# Altium schematic sheet camera.SchDoc
size A3
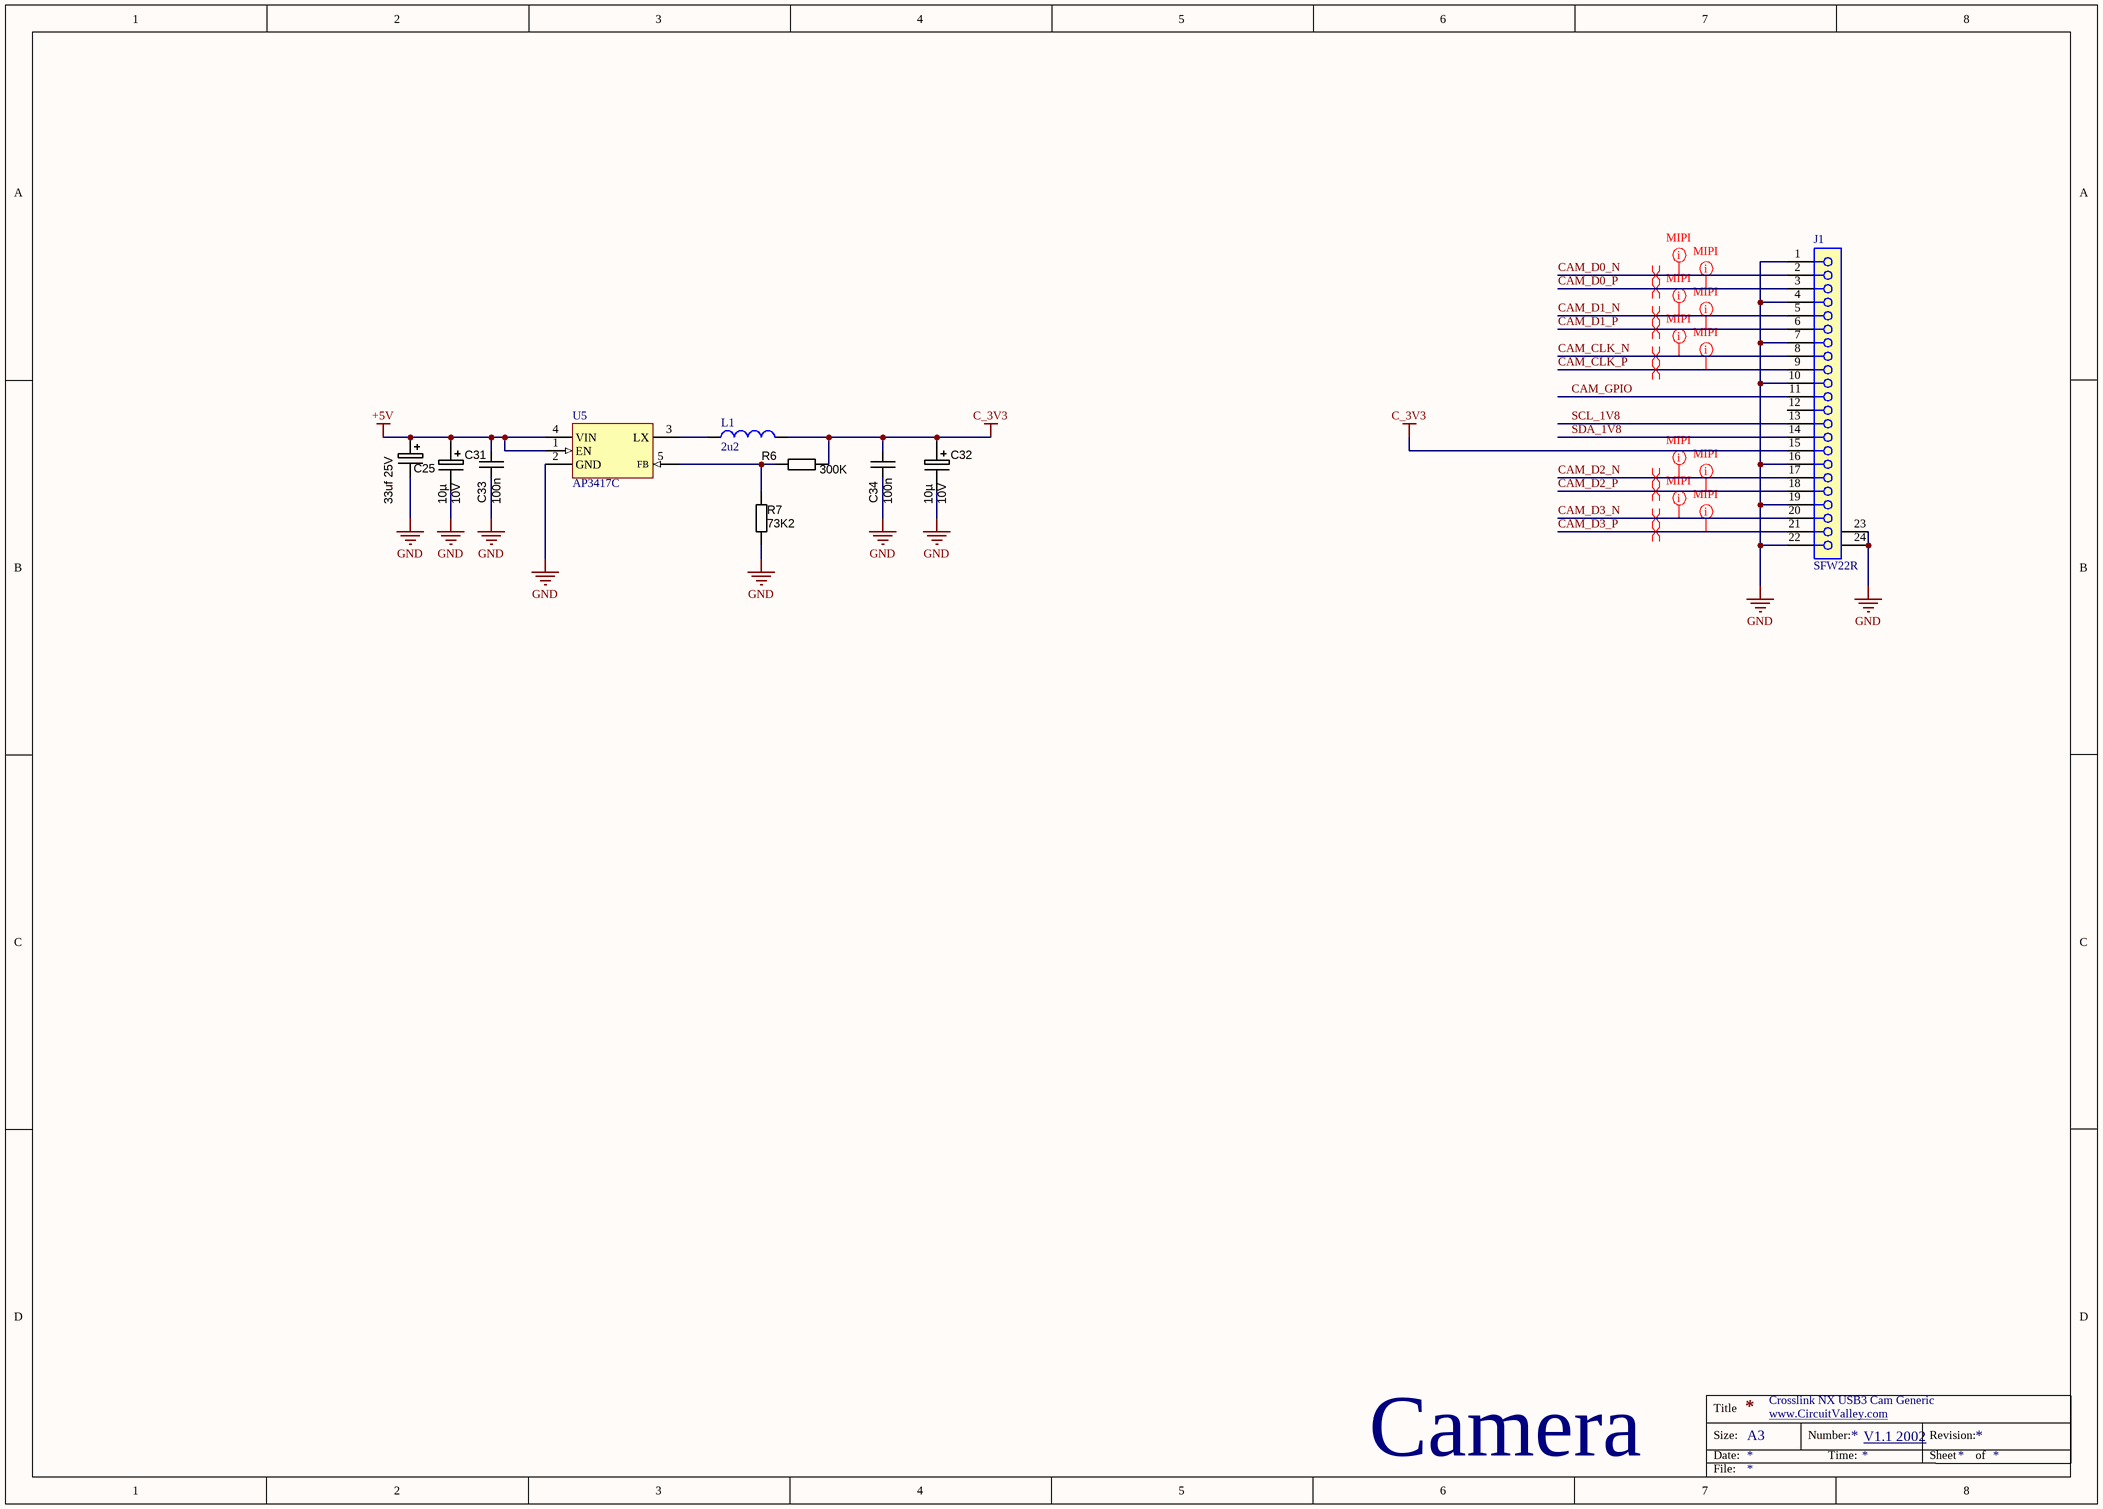
[diagram p0: camera.SchDoc]

## Parts
C25  value 33uf 25V  [CAPMP7343X310N]  (hidden comment: 33uf 20V D)
C31  Ratings: 10V  [CAPMP3528X210N]  (hidden comment: 10µ)
C32  Ratings: 10V  [CAPMP3528X210N]  (hidden comment: 10µ)
C33  100n  [CAPC1608N]
C34  100n  [CAPC1608N]
J1  SFW22R  [SFW22R]
L1  2u2  [TAIYO_NRS4018T2R2MDGJ]
R6  value 300K  [RESC1608N_ZERO]  (hidden comment: Thick Film)
R7  value 73K2  [RESC1608N_ZERO]  (hidden comment: Thick Film)
U5  AP3417C  [SOT23-5]

## Nets
+5V: C25.1 C31.1 C33.2 U5.1(EN) U5.4(VIN)
C_3V3: C32.1 C34.2 J1.15 L1.2 R6.1
GND: C25.2 C31.2 C32.2 C33.1 C34.1 J1.1 J1.4 J1.7 J1.10 J1.16 J1.19 J1.22 J1.23 J1.24 R7.2 U5.2(GND)
CAM_CLK_N: J1.8
CAM_CLK_P: J1.9
CAM_D0_N: J1.2
CAM_D0_P: J1.3
CAM_D1_N: J1.5
CAM_D1_P: J1.6
CAM_D2_N: J1.17
CAM_D2_P: J1.18
CAM_D3_N: J1.20
CAM_D3_P: J1.21
CAM_GPIO: J1.11
SCL_1V8: J1.13
SDA_1V8: J1.14
NetL1_1: L1.1 U5.3(LX)
NetR6_2: R6.2 R7.1 U5.5(FB)

Not connected (* = marked no-connect by the designer): J1 12

## Layout directives
differential pair: CAM_CLK_N, CAM_CLK_P, CAM_D0_N, CAM_D0_P, CAM_D1_N, CAM_D1_P, CAM_D2_N, CAM_D2_P, CAM_D3_N, CAM_D3_P
net class MIPI: CAM_CLK_N, CAM_CLK_P, CAM_D0_N, CAM_D0_P, CAM_D1_N, CAM_D1_P, CAM_D2_N, CAM_D2_P, CAM_D3_N, CAM_D3_P

## Notes on the sheet
- Crosslink NX USB3 Cam Generic
- www.CircuitValley.com <http://www.CircuitValley.com>
- V1.1 2002
- Camera
- Title
- Size:
- Date:
- A3
- Number:
- Time:
- Revision:
- Sheet
- of
- File:

## Library data of the parts
C25 = CAPT_330u_2917_6V3: Capacitor SMD Tant 330uF 20% 6V3 2917; Manufacturer Part Number: T520D337M006ATE015; Part: TAJD336K020R; Ratings: 6.3V; Material: Solid Tantalum; ESR (Equivalent Series Resistance): 15 mOhm; Package / Case: 2917 (7343 Metric); Tolerance: ±20%; Operating Temperature: -55°C ~ 125°C; Size / Dimension: 0.287" L x 0.169" W (7.30mm x 4.30mm); Height - Seated (Max): 0.122" (3.10mm); Manufacturer Size Code: D; Supplier 1: Digi-Key; Supplier Part Number 1: 399-4052-1-ND; ComponentLink1URL: http://www.kemet.com/datasheets&T520D337M006ATE015; ComponentLink1Description: T520D Datasheet
C31 C32 = CAPT_47u_1210_6V3: Capacitor SMD Tantalum 47uF 20% 6.3V 1210; Manufacturer 1: AVX Corporation; Manufacturer Part Number 1: TCJB476M006R0070; Manufacturer Size Code: B; Voltage - Rated: 6V3; ESR (Equivalent Series Resistance): 70.0 mOhm; Type: Molded; Package / Case: 1210 (3528 Metric); Tolerance: ±20%; Material: Tantalum; Supplier 1: Digi-Key; Supplier Part Number 1: 478-3139-1-ND; Operating Temperature: -55°C ~ 125°C; Size / Dimension: 0.138" L x 0.110" W (3.50mm x 2.80mm); Height - Seated (Max): 0.083" (2.10mm); ComponentLink1URL: http://www.avx.com/docs/Catalogs/tcj.pdf; ComponentLink1Description: http://www.avx.com/docs/Catalogs/tcj.pdf; Value: 10µ
C33 C34 = CAPC_10p_0603_NP0_1%_50V: Capacitor SMD Cer 10pF 5% 50V NP0 0603; Manufacturer 1: Murata Electronics North America; Manufacturer Part Number 1: GRM1885C1H100FA01J; Part: C0603X104K5RAC; Ratings: 50V; NP0; Tolerance: ±5%; Operating Temperature: -55°C ~ 125°C; Package / Case: 0603 (1608 Metric); Size / Dimension: 0.063" L x 0.032" W (1.60mm x 0.81mm); Thickness (Max): 0.035" (0.90mm); Supplier 1: Digi-Key; Supplier Part Number 1: GRM1885C1H100FA01J-ND; Value: 100n
J1 = SFW22R: 22 Pin FPC
L1 = inductor_smd: PartNumber: NRS4018T2R2MDGJ
R6 R7 = RES_0R_0603: Resistor SMD chip 0.0 Ohm 0.1W 0603; Manufacturer 1: Vishay/Dale; Manufacturer Part Number 1: CRCW06030000Z0EA; Tolerance: ±5%; Ratings: 1/10W; Package / Case: 0603 (1608metric); Supplier 1: Digi-Key; Supplier Part Number 1: 541-0.0GCT-ND